# EasyEDA Pro project ProProject_阵列式磁场检测仪_2024-06-02.epro, schematic Schematic1
Create Date: 2024-04-22; Page Name: P1; Project Name: 阵列式磁场检测仪; Schematic Name: Schematic1; Update Date: 2024-05-02; Company: 嘉立创EDA; Page Size: A4; Version: V1.0
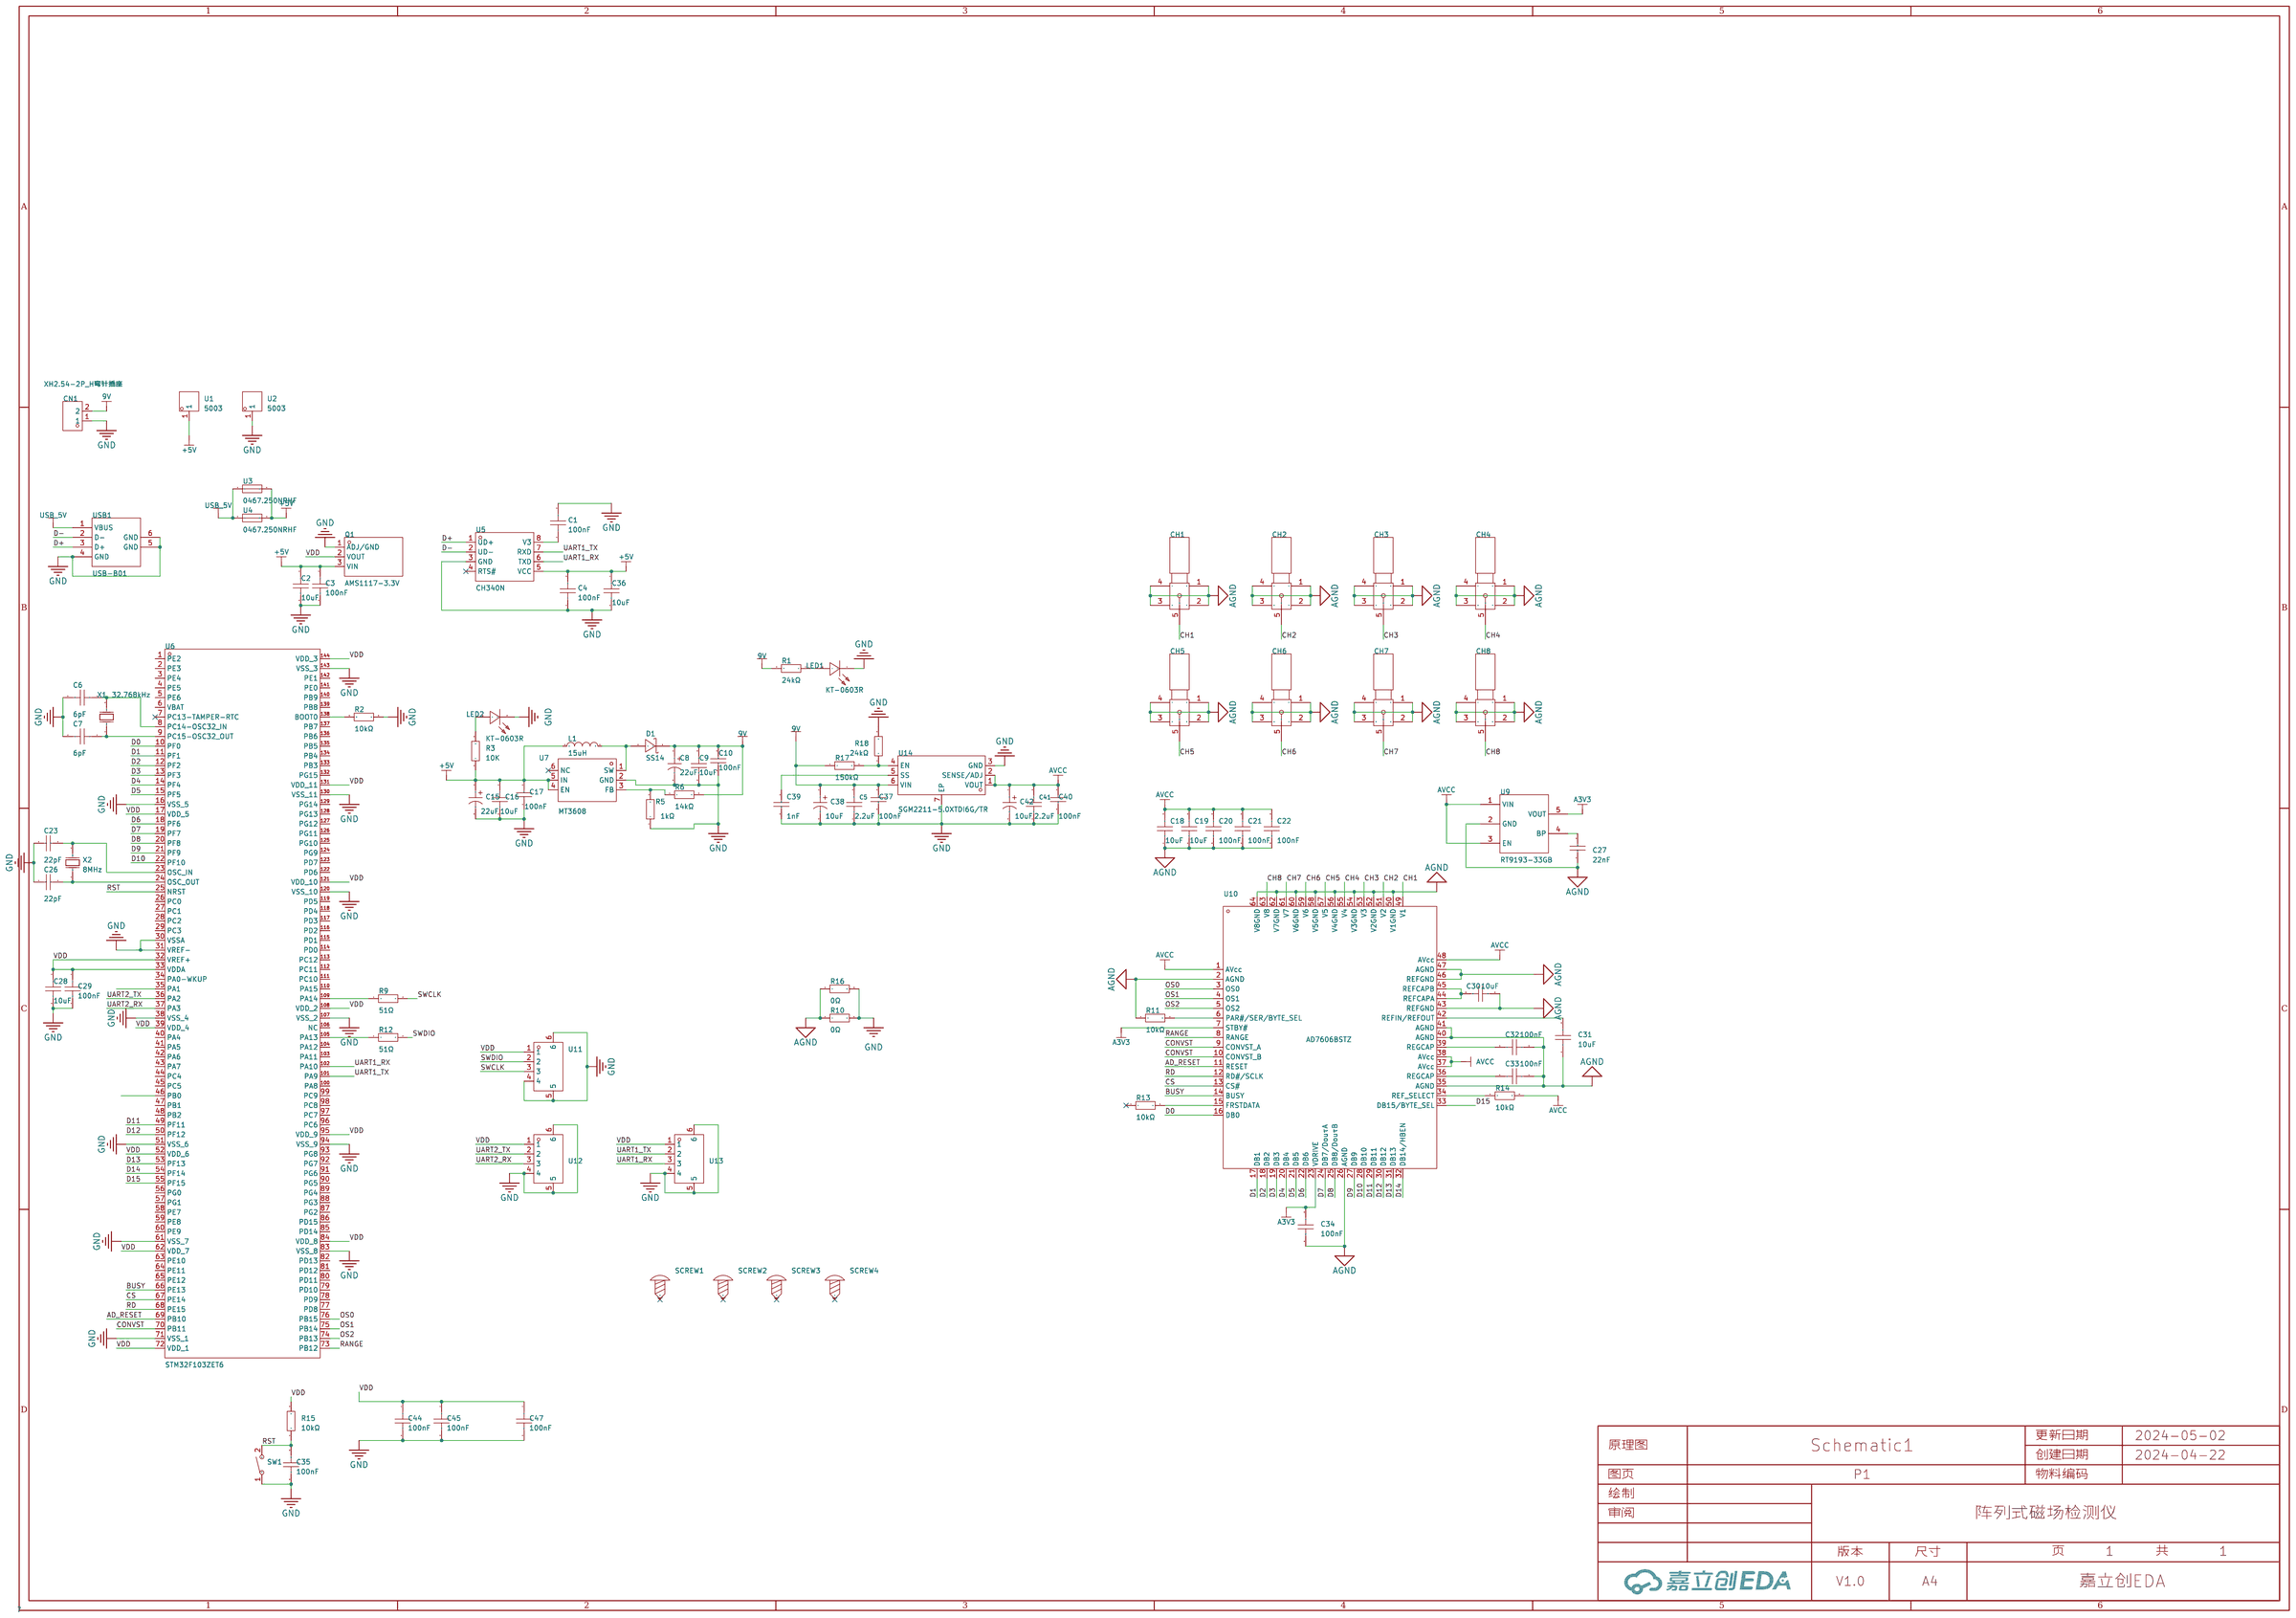
[diagram p0: schematic sheet]

## Parts
C1  100nF  [C0603]
C2  10uF  [C0805]
C3  100nF  [C0603]
C4  100nF  [C0603]
C5  2.2uF  [C0603]
C6  6pF  [C0603]
C7  6pF  [C0603]
C8  22uF  [CAP-SMD_BD5.0-L5.3-W5.3-LS6.0-FD]
C9  10uF  [C0805]
C10  100nF  [C0603]
C15  22uF  [CAP-SMD_BD5.0-L5.3-W5.3-LS6.0-FD]
C16  10uF  [C0805]
C17  100nF  [C0603]
C18  10uF  [C0805]
C19  10uF  [C0805]
C20  100nF  [C0603]
C21  100nF  [C0603]
C22  100nF  [C0603]
C23  22pF  [C0603]
C26  22pF  [C0603]
C27  22nF  [C0603]
C28  10uF  [C0805]
C29  100nF  [C0603]
C30  10uF  [C0805]
C31  10uF  [C0805]
C32  100nF  [C0603]
C33  100nF  [C0603]
C34  100nF  [C0603]
C35  100nF  [C0603]
C36  10uF  [C0805]
C37  100nF  [C0603]
C38  10uF  [CAP-SMD_BD5.0-L5.3-W5.3-FD]
C39  1nF  [C0603]
C40  100nF  [C0603]
C41  2.2uF  [C0603]
C42  10uF  [CAP-SMD_BD5.0-L5.3-W5.3-FD]
C44  100nF  [C0603]
C45  100nF  [C0603]
C47  100nF  [C0603]
CH1  BWSMA-KWE-Z001  [SMA-TH_BWSMA-KWE-Z001]
CH2  BWSMA-KWE-Z001  [SMA-TH_BWSMA-KWE-Z001]
CH3  BWSMA-KWE-Z001  [SMA-TH_BWSMA-KWE-Z001]
CH4  BWSMA-KWE-Z001  [SMA-TH_BWSMA-KWE-Z001]
CH5  BWSMA-KWE-Z001  [SMA-TH_BWSMA-KWE-Z001]
CH6  BWSMA-KWE-Z001  [SMA-TH_BWSMA-KWE-Z001]
CH7  BWSMA-KWE-Z001  [SMA-TH_BWSMA-KWE-Z001]
CH8  BWSMA-KWE-Z001  [SMA-TH_BWSMA-KWE-Z001]
CN1  XH2.54-2P_H弯针插座  [CONN-TH_2P-P2.5_XH2.54-2P_H]
D1  SS14  [SMA_L4.2-W2.6-LS5.3-RD]
L1  15uH  [IND-SMD_L5.2-W5.2_YSPI0530]
LED1  KT-0603R  [LED0603-RD]
LED2  KT-0603R  [LED0603-RD]
Q1  AMS1117-3.3V  [SOT-89-3_L4.5-W2.5-P1.50-LS4.2-BR]
R1  24kΩ  [R0603]
R2  10kΩ  [R0603]
R3  10K  [R0603]
R5  1kΩ  [R0603]
R6  14kΩ  [R0603]
R9  51Ω  [R0603]
R10  0Ω  [R1206]
R11  10kΩ  [R0603]
R12  51Ω  [R0603]
R13  10kΩ  [R0603]
R14  10kΩ  [R0603]
R15  10kΩ  [R0603]
R16  0Ω  [R1206]
R17  150kΩ  [R0603]
R18  24kΩ  [R0603]
SCREW1  -  [M3螺丝]
SCREW2  -  [M3螺丝]
SCREW3  -  [M3螺丝]
SCREW4  -  [M3螺丝]
SW1  TS-1092S-B3D2-G  [SW-SMD_L6.1-W3.6-LS7.9]
U1  5003  [TEST-TH_BD2.54-P1.39]
U2  5003  [TEST-TH_BD2.54-P1.39]
U3  0467.250NRHF  [F0603]
U4  0467.250NRHF  [F0603]
U5  CH340N  [SOP-8_L4.9-W3.9-P1.27-LS6.0-BL]
U6  STM32F103ZET6  [LQFP-144_L20.0-W20.0-P0.50-LS22.0-BL]
U7  MT3608  [SOT-23-6_L2.9-W1.6-P0.95-LS2.8-BL]
U9  RT9193-33GB  [SOT-23-5_L3.0-W1.7-P0.95-LS2.8-BL]
U10  AD7606BSTZ  [LQFP-64_L10.0-W10.0-P0.50-LS12.0-BL]
U11  WAFER-GH1.25-4PWB  [CONN-SMD_4P-P1.25_XUNPU_WAFER-GH1.25-4PWB]
U12  WAFER-GH1.25-4PWB  [CONN-SMD_4P-P1.25_XUNPU_WAFER-GH1.25-4PWB]
U13  WAFER-GH1.25-4PWB  [CONN-SMD_4P-P1.25_XUNPU_WAFER-GH1.25-4PWB]
U14  SGM2211-5.0XTDI6G/TR  [TDFN-6_L2.0-W2.0-P0.65-BL-EP]
USB1  USB-B01  [USB-B-TH_USB-B01]
X1  32.768kHz  [CRYSTAL-SMD_L3.2-W1.5-1]
X2  8MHz  [CRYSTAL-SMD_L5.0-W3.2]

## Library data of the parts
C1 C4 = CC0603KRX7R9BB104: 温度系数:X7R;容值:100nF;电容体长:-;精度:±10%;电容体宽:-;电容体厚度:-;额定电压:50V;; LCSC Part Name: 100nF ±10% 50V; Supplier Part: C14663; Manufacturer: YAGEO(国巨); Supplier Footprint: 0603; JLCPCB Part Class: Basic Part; Datasheet: https://atta.szlcsc.com/upload/public/pdf/source/20170116/1484561234239.pdf; Supplier: LCSC; Tolerance: ±10%; Voltage Rated: 50V; Temperature Coefficient: X7R
C2 C9 C16 C18 C19 C28 C30 C31 C36 = CL21A106KAYNNNE_C15850: 容值:10uF;精度:±10%;额定电压:25V;材质(温度系数):X5R;; LCSC Part Name: 10uF ±10% 25V; Supplier Part: C15850; Manufacturer: SAMSUNG(三星); Manufacturer Part: CL21A106KAYNNNE; Supplier Footprint: 0805; Datasheet: https://atta.szlcsc.com/upload/public/pdf/source/20160218/1457707763339.pdf; Supplier: LCSC; Tolerance: ±10%; Voltage Rated: 25V; Temperature Coefficient: X5R
C3 C20-C22 C29 C32-C35 C44 C45 C47 = CC0603KRX7R9BB104: 容值:100nF;精度:±10%;额定电压:50V;材质(温度系数):X7R;; LCSC Part Name: 100nF ±10% 50V; Supplier Part: C14663; Manufacturer: YAGEO(国巨); Supplier Footprint: 0603; Datasheet: https://atta.szlcsc.com/upload/public/pdf/source/20180910/C282072_33301C7F631E79921B82A8DAC6BCC5B3.pdf; Supplier: LCSC; Tolerance: ±10%; Voltage Rated: 50V; Temperature Coefficient: X7R
C5 C41 = CL10A225KB8NNNC: 容值:2.2uF;精度:±10%;额定电压:50V;材质(温度系数):X5R;; LCSC Part Name: 2.2uF ±10% 50V; Supplier Part: C913904; Manufacturer: SAMSUNG(三星); Supplier Footprint: 0603; Datasheet: https://atta.szlcsc.com/upload/public/pdf/source/20160218/1457707763339.pdf; Supplier: LCSC; Tolerance: ±10%; Voltage Rated: 50V; Temperature Coefficient: X5R
C6 C7 = CGA3E2C0G1H060D080AD: 容值:6pF;额定电压:50V;材质(温度系数):C0G;; LCSC Part Name: 6pF 50V; Supplier Part: C2182750; Manufacturer: TDK; Supplier Footprint: 0603; JLCPCB Part Class: 扩展库; Datasheet: https://atta.szlcsc.com/upload/public/pdf/source/20210427/4892FA4C59E7E6B03D1B6D7A54E21E17.pdf; Supplier: LCSC; Voltage Rated: 50V; Temperature Coefficient: C0G
C8 C15 = RVT22UF25V67RV0047: 容值:22uF;精度:±20%;额定电压:25V;纹波电流:26mA@120Hz;等效串联电阻:-;; LCSC Part Name: 22uF ±20% 25V; Supplier Part: C2895283; Manufacturer: KNSCHA(科尼盛); Supplier Footprint: SMD,D5xL5.4mm; Datasheet: https://atta.szlcsc.com/upload/public/pdf/source/20210913/932E3E330BEA7074461466B23B823DC6.pdf; Supplier: LCSC; Tolerance: ±20%; Rated Voltage: 25V; Ripple Current: 26mA@120Hz; φD: 5mm; L: 5.4mm; Lifetime @ Temp: 2000hrs@105℃; Operating Temperature: -55℃~+105℃
C10 C17 C37 C40 = 0603B104K500NT: 容值:100nF;精度:±10%;额定电压:50V;材质(温度系数):X7R;; LCSC Part Name: 100nF ±10% 50V; Supplier Part: C30926; Manufacturer: FH(风华); Supplier Footprint: 0603; Datasheet: https://atta.szlcsc.com/upload/public/pdf/source/20200305/C486355_26A10D38EF8C2A5C37091D0039909270.pdf; Supplier: LCSC; Tolerance: ±10%; Voltage Rated: 50V; Temperature Coefficient: X7R
C23 C26 = CL10C220JB8NNNC: 容值:22pF;精度:±5%;额定电压:50V;材质(温度系数):C0G;; LCSC Part Name: 22pF ±5% 50V; Supplier Part: C1653; Manufacturer: SAMSUNG(三星); Supplier Footprint: 0603; Datasheet: https://atta.szlcsc.com/upload/public/pdf/source/20160218/1457707763339.pdf; Supplier: LCSC; Tolerance: ±5%; Voltage Rated: 50V; Temperature Coefficient: C0G
C27 = CL10B223KB8NNNC: 容值:22nF;精度:±10%;额定电压:50V;材质(温度系数):X7R;; LCSC Part Name: 22nF ±10% 50V; Supplier Part: C21122; Manufacturer: SAMSUNG(三星); Supplier Footprint: 0603; Datasheet: https://atta.szlcsc.com/upload/public/pdf/source/20160218/1457707763339.pdf; Supplier: LCSC; Tolerance: ±10%; Voltage Rated: 50V; Temperature Coefficient: X7R
C38 C42 = RST10UF50V016: 容值:10uF;精度:±20%;额定电压:50V;纹波电流:24mA@120Hz;等效串联电阻:-;; LCSC Part Name: 10uF ±20% 50V; Supplier Part: C4747971; Manufacturer: KNSCHA(科尼盛); Supplier Footprint: SMD,D5xL5.4mm; Datasheet: https://atta.szlcsc.com/upload/public/pdf/source/20220722/47144637C831FC4476CE4962252D8002.pdf; Supplier: LCSC; Tolerance: ±20%; Rated Voltage: 50V; Ripple Current: 24mA@120Hz; φD: 5mm; L: 5.4mm; Lifetime @ Temp: 2000hrs@105℃; Operating Temperature: -40℃~+105℃
C39 = CC0603KRX7R9BB102: 容值:1nF;精度:±10%;额定电压:50V;材质(温度系数):X7R;; LCSC Part Name: 1nF ±10% 50V; Supplier Part: C100040; Manufacturer: YAGEO(国巨); Supplier Footprint: 0603; Datasheet: https://atta.szlcsc.com/upload/public/pdf/source/20180910/C282072_33301C7F631E79921B82A8DAC6BCC5B3.pdf; Supplier: LCSC; Tolerance: ±10%; Voltage Rated: 50V; Temperature Coefficient: X7R
CH1-CH8 = BWSMA-KWE-Z001: 连接器类型:板端;接口类型:内孔;端口数量:1;接口直径:5.3mm;接口长度/高度:-;频率-最大值:-;射频系列:SMA;阻抗:50Ω;样式:弯头;触头材质:-;触头镀层:-;工作温度范围:-;焊接温度(最大值):-;; LCSC Part Name: 内孔 SMA 弯头; Supplier Part: C496551; Manufacturer: BAT WIRELESS(蝙蝠无线); Supplier Footprint: 插件; Datasheet: https://atta.szlcsc.com/upload/public/pdf/source/20231017/997A8C2ADA7F8034A89BE1264F38CE52.pdf; Supplier: LCSC; Connector Type: 板端; Interface Type: 内孔; Number of Ports: 1; Interface Diameter: 5.3mm; RF Series: SMA; Impedance: 50Ω; Style: 弯头
CN1 = XH2.54-2P_H弯针插座: Supplier Part: C2915111; Supplier Footprint: TH-2P; JLCPCB Part Class: 扩展库; Supplier: LCSC
D1 = SS14_C2480: 二极管配置:独立式;正向压降(Vf):550mV@1A;直流反向耐压(Vr):40V;平均整流电流(Io):1A;; LCSC Part Name: 电压:40V 电流:1A; Supplier Part: C2480; Manufacturer: MDD; Supplier Footprint: SMA(DO-214AC); Datasheet: https://atta.szlcsc.com/upload/public/pdf/source/20230712/2DB6064CFBB99DE6DB116BEE8208BE66.pdf; Supplier: LCSC; Diode Configuration: 独立式; Forward Voltage (Vf@If): 550mV@1A; Reverse Voltage (Vr): 40V; Average Rectified Current (Io): 1A; Reverse Leakage Current (Ir): 500uA@40V
L1 = YSPI0530-150M: 电感值:15uH;精度:±20%;额定电流:2.1A;; LCSC Part Name: 15uH ±20%; Supplier Part: C497861; Manufacturer: YJYCOIN(益嘉源); Supplier Footprint: SMD,5.4x5.2x3mm; Datasheet: https://atta.szlcsc.com/upload/public/pdf/source/20200317/C497860_F2BFA4F4324DE880FC2D7AD862E4A32B.pdf; Supplier: LCSC; Tolerance: ±20%; Rated Current: 2.1A; DC Resistance (DCR): 190mΩ
LED1 LED2 = KT-0603R: 发光颜色:红色;功率:-;正向电流:-;主波长:-;二极管配置:-;透镜颜色:-;色温:-;发光角度:-;载带方式:-;工作温度:-40℃~+85℃;; LCSC Part Name: 0603 红灯 高亮; Supplier Part: C2286; Manufacturer: KENTO; Supplier Footprint: 0603; JLCPCB Part Class: 基础库; Datasheet: https://atta.szlcsc.com/upload/public/pdf/source/20160616/1466072038404.pdf; Supplier: LCSC; Emitted Color: 红色; Operating Temperature: -40℃~+85℃
Q1 = AMS1117-3.3V_C5120796: 输出类型:固定;最大输入电压:18V;输出电压:3.3V;最大输出电流:1A;输出极性:正极;; LCSC Part Name: 输入18V 输出3.3V 1A; Supplier Part: C5120796; Manufacturer: MSKSEMI(美森科); Supplier Footprint: SOT-89; Datasheet: https://atta.szlcsc.com/upload/public/pdf/source/20231123/6117526697EB8BF6175FDEEBA0877266.pdf; Supplier: LCSC; Output Type: 固定; Maximum Input Voltage: 18V; Output Voltage: 3.3V; MAX Output Current: 1A; Dropout Voltage: 1.4V@(1A); standby current: 12mA; Operating Temperature: 0℃~+125℃; Output Polarity: 正极; Number of Outputs: 1
R1 R18 = 0603WAF2402T5E: 电阻类型:厚膜电阻;阻值:24kΩ;精度:±1%;功率:100mW;最大工作电压:75V;温度系数:±100ppm/℃;; LCSC Part Name: 24kΩ ±1% 100mW 厚膜电阻; Supplier Part: C23352; Manufacturer: UNI-ROYAL(厚声); Supplier Footprint: 0603; JLCPCB Part Class: 基础库; Datasheet: https://atta.szlcsc.com/upload/public/pdf/source/20200306/C422600_1E6D84923E4A46A82E41ADD87F860B5C.pdf; Supplier: LCSC; Type: 厚膜电阻; Tolerance: ±1%; Power(Watts): 100mW; Overload Voltage (Max): 75V; Temperature Coefficient: ±100ppm/℃; Operating Temperature Range: -55℃~+155℃
R2 R11 R13-R15 = 0603WAF1002T5E: 电阻类型:厚膜电阻;阻值:10kΩ;精度:±1%;功率:100mW;最大工作电压:75V;温度系数:±100ppm/℃;; LCSC Part Name: 厚膜电阻 10kΩ ±1% 100mW; Supplier Part: C25804; Manufacturer: UNI-ROYAL(厚声); Supplier Footprint: 0603; Datasheet: https://atta.szlcsc.com/upload/public/pdf/source/20200306/C422600_1E6D84923E4A46A82E41ADD87F860B5C.pdf; Supplier: LCSC; Type: 厚膜电阻; Tolerance: ±1%; Power(Watts): 100mW; Overload Voltage (Max): 75V; Temperature Coefficient: ±100ppm/℃; Operating Temperature Range: -55℃~+155℃
R3 = Res_0603: Supplier Footprint: 0603
R5 = 0603WAF1001T5E: 电阻类型:厚膜电阻;阻值:1kΩ;精度:±1%;功率:100mW;最大工作电压:75V;温度系数:±100ppm/℃;; LCSC Part Name: 1kΩ ±1% 100mW 厚膜电阻; Supplier Part: C21190; Manufacturer: UNI-ROYAL(厚声); Supplier Footprint: 0603; Datasheet: https://atta.szlcsc.com/upload/public/pdf/source/20200306/C422600_1E6D84923E4A46A82E41ADD87F860B5C.pdf; Supplier: LCSC; Type: 厚膜电阻; Tolerance: ±1%; Power(Watts): 100mW; Overload Voltage (Max): 75V; Temperature Coefficient: ±100ppm/℃; Operating Temperature Range: -55℃~+155℃
R6 = 0603WAF1402T5E: 电阻类型:厚膜电阻;阻值:14kΩ;精度:±1%;功率:100mW;最大工作电压:75V;温度系数:±100ppm/℃;; LCSC Part Name: 14kΩ ±1% 100mW 厚膜电阻; Supplier Part: C22803; Manufacturer: UNI-ROYAL(厚声); Supplier Footprint: 0603; Datasheet: https://atta.szlcsc.com/upload/public/pdf/source/20200306/C422600_1E6D84923E4A46A82E41ADD87F860B5C.pdf; Supplier: LCSC; Type: 厚膜电阻; Tolerance: ±1%; Power(Watts): 100mW; Overload Voltage (Max): 75V; Temperature Coefficient: ±100ppm/℃; Operating Temperature Range: -55℃~+155℃
R9 R12 = 0603WAF510JT5E: 电阻类型:厚膜电阻;阻值:51Ω;精度:±1%;功率:100mW;最大工作电压:75V;温度系数:±100ppm/℃;; LCSC Part Name: 51Ω ±1% 100mW 厚膜电阻; Supplier Part: C23197; Manufacturer: UNI-ROYAL(厚声); Supplier Footprint: 0603; Datasheet: https://atta.szlcsc.com/upload/public/pdf/source/20200306/C422600_1E6D84923E4A46A82E41ADD87F860B5C.pdf; Supplier: LCSC; Type: 厚膜电阻; Tolerance: ±1%; Power(Watts): 100mW; Overload Voltage (Max): 75V; Temperature Coefficient: ±100ppm/℃; Operating Temperature Range: -55℃~+155℃
R10 R16 = 1206W4F0000T5E: 电阻类型:厚膜电阻;阻值:0Ω;精度:±1%;功率:250mW;最大工作电压:200V;温度系数:±800ppm/℃;; LCSC Part Name: 0Ω ±1% 250mW 厚膜电阻; Supplier Part: C17888; Manufacturer: UNI-ROYAL(厚声); Supplier Footprint: 1206; JLCPCB Part Class: 基础库; Datasheet: https://atta.szlcsc.com/upload/public/pdf/source/20200306/C422600_1E6D84923E4A46A82E41ADD87F860B5C.pdf; Supplier: LCSC; Type: 厚膜电阻; Tolerance: ±1%; Power(Watts): 250mW; Overload Voltage (Max): 200V; Temperature Coefficient: ±800ppm/℃; Operating Temperature Range: -55℃~+155℃
R17 = 0603WAF1503T5E: 电阻类型:厚膜电阻;阻值:150kΩ;精度:±1%;功率:100mW;最大工作电压:75V;温度系数:±100ppm/℃;; LCSC Part Name: 150kΩ ±1% 100mW 厚膜电阻; Supplier Part: C22807; Manufacturer: UNI-ROYAL(厚声); Supplier Footprint: 0603; JLCPCB Part Class: 基础库; Datasheet: https://atta.szlcsc.com/upload/public/pdf/source/20200306/C422600_1E6D84923E4A46A82E41ADD87F860B5C.pdf; Supplier: LCSC; Type: 厚膜电阻; Tolerance: ±1%; Power(Watts): 100mW; Overload Voltage (Max): 75V; Temperature Coefficient: ±100ppm/℃; Operating Temperature Range: -55℃~+155℃
SCREW1-SCREW4 = M3螺丝: Supplier Footprint: 插件
SW1 = TS-1092S-B3D2-G: 电路结构:单刀单掷;按钮形状:矩形按钮;作用力:250gf;安装方式:立贴;开关长度:6.1mm;开关宽度:3.6mm;开关高度:2.5mm;带支架:不带;机械寿命:-;; LCSC Part Name: 6.1*3.6*2.5mm 立贴 轻触开关; Supplier Part: C520860; Manufacturer: Yuandi(元迪); Supplier Footprint: SMD; Datasheet: https://atta.szlcsc.com/upload/public/pdf/source/20200424/C520860_DA5AE47D9A9DC527FC720B5FF0895739.pdf; Supplier: LCSC; Circuit: 单刀单掷; Actuator Style: 矩形按钮; Operating Force: 250gf; Mounting Style: 立贴; Switch Length: 6.1mm; Switch Width: 3.6mm; Switch Height: 2.5mm; Strike Gundam: 不带; Actuator/Cap Color: 灰色; Pin Style: 鸥翼型
U1 U2 = 5003: 类型:测试环;全长/全高:7.62mm;工作高度:-;接触电阻:-;弹性寿命:-;额定电流:-;额定电压:-;触头材质:磷青铜;触头镀层:-;工作温度范围:-;; Supplier Part: C238124; Manufacturer: Keystone; Datasheet: https://atta.szlcsc.com/upload/public/pdf/source/20211115/64B944F8418AA2CF0680BB1B201435FB.pdf; Supplier: LCSC; Type: 测试环; Overall Length/Height: 7.62mm; Contact Material: 磷青铜
U3 U4 = 0467.250NRHF: 类型:贴片式保险丝;额定电流:250mA;额定电压 (AC):32V;额定电压 (DC):32V;分断能力:50A;; LCSC Part Name: 32V贴片式保险丝; Supplier Part: C151137; Manufacturer: Littelfuse(美国力特); Supplier Footprint: 0603; Datasheet: https://atta.szlcsc.com/upload/public/pdf/source/20171201/C151140_15121178500441156397.pdf; Supplier: LCSC; Type: 贴片式保险丝; Current Rating: 250mA; Voltage Rating  (AC): 32V; Voltage Rating (DC): 32V; Operating Temperature: -55℃~+90℃; Breaking Capacity: 50A
U5 = CH340N: Supplier Part: C2977777; Manufacturer: WCH(南京沁恒); Supplier Footprint: SOP-8; JLCPCB Part Class: Extended Part; Datasheet: https://atta.szlcsc.com/upload/public/pdf/source/20220223/82A45E4FF89B3EDCAD50B354450A7EF4.pdf; Supplier: LCSC
U6 = STM32F103ZET6: CPU内核:CM3;程序存储容量:512KB;RAM总容量:64KB;GPIO端口数量:112;工作电压范围:2V~3.6V;CPU最大主频:72MHz;程序存储器类型:FLASH;; Supplier Part: C8287; Manufacturer: ST(意法半导体); Supplier Footprint: LQFP-144(20x20); Datasheet: https://atta.szlcsc.com/upload/public/pdf/source/20180327/C88435_0E51D69B5FFD7B1A3F36EB9FC047A4C2.pdf; Supplier: LCSC; CPU Core: CM3; Program Storage Size: 512KB; RAM Size: 64KB; GPIO Ports Number: 112; Operating Voltage Range: 2V~3.6V; CPU Maximum Speed: 72MHz; Program Memory Type: FLASH; Operating Temperature Range: -40℃~+85℃; ADC (Bit): 12bit; DAC (Bit): 12bit; Universal Serial Bus: 有; Peripheral/Function: DMA；片载温度传感器；PWM; Watchdog: 有; Infrared Data Association: 有; Low-Voltage Detect: 有; Direct Memory Access: 有; Internal Oscillator: 有
U7 = MT3608: 功能类型:升压型;输入电压:2V~24V;输出电压:28V;输出电流(最大值):-;; Supplier Part: C84817; Manufacturer: 西安航天民芯; Supplier Footprint: SOT-23-6; JLCPCB Part Class: 扩展库; Datasheet: https://atta.szlcsc.com/upload/public/pdf/source/20161110/1478743351706.pdf; Supplier: LCSC; Function: 升压型; Input Voltage: 2V~24V; Output Voltage: 28V; Switching Frequency: 1.2MHz; Number of Outputs: 1; Topology: 升压式; Switch tube (built-in/external): 内置
U9 = RT9193-33GB: 输出类型:固定;最大输入电压:5.5V;输出电压:3.3V;最大输出电流:300mA;电源纹波抑制比(PSRR):70dB;输出极性:正极;; LCSC Part Name: 输入5.5V 输出3.3V 300mA; Supplier Part: C15651; Manufacturer: RICHTEK(立锜); Supplier Footprint: SOT-23-5; Datasheet: https://atta.szlcsc.com/upload/public/pdf/source/20130730/1457706628575.pdf; Supplier: LCSC; Output Type: 固定; Maximum Input Voltage: 5.5V; Output Voltage: 3.3V; MAX Output Current: 300mA; Power Supply Rejection Ratio (PSRR): 70dB; Dropout Voltage: 300mV@(300mA); standby current: 130uA; Operating Temperature: -40℃~+125℃; Output Polarity: 正极; Number of Outputs: 1
U10 = AD7606BSTZ: 供电电压:2.3V~5.25V；4.75V~5.25V;分辨率(位):16;; LCSC Part Name: 8通道 200kHz 16位ADC DSP接口; Supplier Part: C398827; Manufacturer: ADI(亚德诺); Supplier Footprint: LQFP-64(10x10); Datasheet: https://atta.szlcsc.com/upload/public/pdf/source/20200312/C495029_477E5B714CC8ADA3D7A4ECEA0C949302.pdf; Supplier: LCSC; Supply Voltage: 2.3V~5.25V；4.75V~5.25V; Number of Channels: 8; Resolution: 16; Operating Temperature: -40℃~+85℃
U11-U13 = WAFER-GH1.25-4PWB: 插针结构:1x4P;间距:1.25mm;安装方式:卧贴;参考系列:GH;总PIN数:4P;排数:1;每排PIN数:4;额定电流:1A;工作温度范围:-25℃~+85℃;; LCSC Part Name: 1x4P 间距:1.25mm 卧贴 系列:GH; Supplier Part: C3029379; Manufacturer: XUNPU(讯普); Supplier Footprint: SMD,P=1.25mm,卧贴; Datasheet: https://atta.szlcsc.com/upload/public/pdf/source/20220527/CB8773BFB0913C3B8ABD62CB38BA101A.pdf; Supplier: LCSC; Pins Structure: 1x4P; Pitch: 1.25mm; Mounting Style: 卧贴; Reference Series: GH; Number of Pins: 4P; Number of Rows: 1; Number of PINs Per Row: 4; Current Rating (Max): 1A; Operating Temperature Range: -25℃~+85℃
U14 = SGM2211-1.8XTDI6G/TR: Supplier Part: C5152834; Manufacturer: SGMICRO(圣邦微); Supplier Footprint: TDFN-6AL(2x2); JLCPCB Part Class: 扩展库; Datasheet: https://atta.szlcsc.com/upload/public/pdf/source/20220928/26A0674FCF0885761ED3B533E1830369.pdf; Supplier: LCSC
USB1 = USB-B01: 连接器类型:Type-B;标准:USB 2.0;公母:母;端口数量:1;触点数量:4P;安装方式:弯插;额定电流 - 电源:-;工作温度范围:-;; LCSC Part Name: Type-B 母 弯插; Supplier Part: C498173; Manufacturer: SOFNG(硕方); Supplier Footprint: 插件; Datasheet: https://atta.szlcsc.com/upload/public/pdf/source/20200812/C498173_CFDA774068C8841191F9DEBD85971FB5.pdf; Supplier: LCSC; Connector Type: Type-B; Standard: USB 2.0; Gender: 母; Number of Ports: 1; Number of Contacts: 4P; Mounting Style: 弯插
X1 = XKXGI-SUA-32.768K: 晶振类型:贴片晶振;频率:32.768kHz;常温频差:±20ppm;外接负载电容:12.5pF;频率稳定度(全温):±30ppm;; LCSC Part Name: 32.768kHz ±20ppm 12.5pF YST310S; Supplier Part: C5213671; Manufacturer: YXC(扬兴晶振); Supplier Footprint: SMD3215-2P; JLCPCB Part Class: 扩展库; Datasheet: https://atta.szlcsc.com/upload/public/pdf/source/20240329/3A7650FD985DD0DE85694D3785AB4916.pdf; Supplier: LCSC; Crystal Type: 贴片晶振; Normal temperature Frequency Tolerance: ±20ppm; External load capacitor: 12.5pF; Frequency Stability(Full temperature range): ±30ppm; Operating Temperature: -40℃~+85℃
X2 = X50328MSB2GI: 晶振类型:贴片晶振;频率:8MHz;常温频差:±10ppm;外接负载电容:20pF;频率稳定度(全温):±20ppm;; LCSC Part Name: 8MHz ±10ppm 20pF YSX530GA; Supplier Part: C115962; Manufacturer: YXC(扬兴晶振); Supplier Footprint: SMD5032; Datasheet: https://atta.szlcsc.com/upload/public/pdf/source/20240329/44922B0AF7B60E58E9B66993B6077277.pdf; Supplier: LCSC; Crystal Type: 贴片晶振; Normal temperature Frequency Tolerance: ±10ppm; External load capacitor: 20pF; Frequency Stability(Full temperature range): ±20ppm; Operating Temperature: -40℃~+85℃

## Nets
9V: C5.2 C8.1 C9.2 C10.2 C37.2 C38.1 CN1.2 D1.1(K) R1.2 R6.2 R17.1 U14.6(VIN)
+5V: C2.1 C3.1 C4.2 C15.1 C16.1 C17.2 C36.1 L1.1 Q1.3(VIN) R3.1 U1.1 U3.2 U4.2 U5.5(VCC) U7.4(EN) U7.5(IN)
A3V3: C34.2 U9.5(VOUT) U10.7(STBY#) U10.23(VDRIVE)
AGND: C18.1 C19.1 C20.2 C21.2 C22.2 C27.1 C30.1 C31.1 C32.1 C33.1 C34.1 CH1.1 CH1.2 CH1.3 CH1.4 CH2.1 CH2.2 CH2.3 CH2.4 CH3.1 CH3.2 CH3.3 CH3.4 CH4.1 CH4.2 CH4.3 CH4.4 CH5.1 CH5.2 CH5.3 CH5.4 CH6.1 CH6.2 CH6.3 CH6.4 CH7.1 CH7.2 CH7.3 CH7.4 CH8.1 CH8.2 CH8.3 CH8.4 R10.1 R11.1 R16.1 U9.2(GND) U10.2(AGND) U10.26(AGND) U10.35(AGND) U10.40(AGND) U10.41(AGND) U10.43(REFGND) U10.46(REFGND) U10.47(AGND) U10.50(V1GND) U10.52(V2GND) U10.54(V3GND) U10.56(V4GND) U10.58(V5GND) U10.60(V6GND) U10.62(V7GND) U10.64(V8GND)
AVCC: C18.2 C19.2 C20.1 C21.1 C22.1 C40.2 C41.2 C42.1 R14.2 U9.1(VIN) U9.3(EN) U10.1(AVcc) U10.37(AVcc) U10.38(AVcc) U10.48(AVcc) U14.1(VOUT) U14.2(SENSE/ADJ)
GND: C1.2 C2.2 C3.2 C4.1 C5.1 C6.2 C7.2 C8.2 C9.1 C10.1 C15.2 C16.2 C17.1 C23.1 C26.1 C28.2 C29.2 C35.2 C36.2 C37.1 C38.2 C39.2 C40.1 C41.1 C42.2 C44.2 C45.2 C47.2 CN1.1 LED1.1(K) LED2.1(K) Q1.1(ADJ/GND) R2.2 R5.1 R10.2 R16.2 R18.2 SW1.1 U2.1 U5.3(GND) U6.16(VSS_5) U6.30(VSSA) U6.31(VREF-) U6.38(VSS_4) U6.51(VSS_6) U6.61(VSS_7) U6.71(VSS_1) U6.83(VSS_8) U6.94(VSS_9) U6.107(VSS_2) U6.120(VSS_10) U6.130(VSS_11) U6.143(VSS_3) U7.2(GND) U11.4 U11.5 U11.6 U12.4 U12.5 U12.6 U13.4 U13.5 U13.6 U14.3(GND) U14.7(EP) USB1.4(GND) USB1.5(GND) USB1.6(GND)
VDD: C28.1 C29.1 C44.1 C45.1 C47.1 Q1.2(VOUT) R15.2 U6.17(VDD_5) U6.32(VREF+) U6.33(VDDA) U6.39(VDD_4) U6.52(VDD_6) U6.62(VDD_7) U6.72(VDD_1) U6.84(VDD_8) U6.95(VDD_9) U6.108(VDD_2) U6.121(VDD_10) U6.131(VDD_11) U6.144(VDD_3) U11.1 U12.1 U13.1
AD_RESET: U6.69(PB10) U10.11(RESET)
BUSY: U6.66(PE13) U10.14(BUSY)
CH1: CH1.5 U10.49(V1)
CH2: CH2.5 U10.51(V2)
CH3: CH3.5 U10.53(V3)
CH4: CH4.5 U10.55(V4)
CH5: CH5.5 U10.57(V5)
CH6: CH6.5 U10.59(V6)
CH7: CH7.5 U10.61(V7)
CH8: CH8.5 U10.63(V8)
CONVST: U6.70(PB11) U10.9(CONVST_A) U10.10(CONVST_B)
CS: U6.67(PE14) U10.13(CS#)
D0: U6.10(PF0) U10.16(DB0)
D1: U6.11(PF1) U10.17(DB1)
D2: U6.12(PF2) U10.18(DB2)
D3: U6.13(PF3) U10.19(DB3)
D4: U6.14(PF4) U10.20(DB4)
D5: U6.15(PF5) U10.21(DB5)
D6: U6.18(PF6) U10.22(DB6)
D7: U6.19(PF7) U10.24(DB7/DouτA)
D8: U6.20(PF8) U10.25(DB8/DouτB)
D9: U6.21(PF9) U10.27(DB9)
D10: U6.22(PF10) U10.28(DB10)
D11: U6.49(PF11) U10.29(DB11)
D12: U6.50(PF12) U10.30(DB12)
D13: U6.53(PF13) U10.31(DB13)
D14: U6.54(PF14) U10.32(DB14/HBEN)
D15: U6.55(PF15) U10.33(DB15/BYTE_SEL)
D+: U5.1(UD+) USB1.3(D+)
D-: U5.2(UD-) USB1.2(D-)
OS0: U6.76(PB15) U10.3(OS0)
OS1: U6.75(PB14) U10.4(OS1)
OS2: U6.74(PB13) U10.5(OS2)
RANGE: U6.73(PB12) U10.8(RANGE)
RD: U6.68(PE15) U10.12(RD#/SCLK)
RST: C35.1 R15.1 SW1.2 U6.25(NRST)
SWCLK: R9.2 U11.3
SWDIO: R12.2 U11.2
UART1_RX: U5.6(TXD) U6.102(PA10) U13.3
UART1_TX: U5.7(RXD) U6.101(PA9) U13.2
UART2_RX: U6.37(PA3) U12.3
UART2_TX: U6.36(PA2) U12.2
USB_5V: U3.1 U4.1 USB1.1(VBUS)
$1N3529: R11.2 U10.6(PAR#/SER/BYTE_SEL)
$1N3639: R13.2 U10.15(FRSTDATA)
$1N3819: R14.1 U10.34(REF_SELECT)
$1N4046: C32.2 U10.39(REGCAP)
$1N4049: C33.2 U10.36(REGCAP)
$1N4205: C31.2 U10.42(REFIN/REFOUT)
$1N4225: C30.2 U10.44(REFCAPA) U10.45(REFCAPB)
$1N5513: C6.1 U6.8(PC14-OSC32_IN) X1.2(OSC2)
$1N5519: C7.1 U6.9(PC15-OSC32_OUT) X1.1(OSC1)
$1N5854: C23.2 U6.23(OSC_IN) X2.2(OSC2)
$1N5860: C26.2 U6.24(OSC_OUT) X2.1(OSC1)
$1N6160: R2.1 U6.138(BOOT0)
$1N8425: R9.1 U6.109(PA14)
$1N8434: R12.1 U6.105(PA13)
$1N8625: C1.1 U5.8(V3)
$1N9988: D1.2(A) L1.2 U7.1(SW)
$1N9991: R5.2 R6.1 U7.3(FB)
$1N10007: LED2.2(A) R3.2
$1N10732: LED1.2(A) R1.1
$1N10962: C27.2 U9.4(BP)
$1N11961: C39.1 U14.5(SS)
$1N11962: R17.2 R18.1 U14.4(EN)

Not connected (* = marked no-connect by the designer): R13 1*; SCREW1 1*; SCREW2 1*; SCREW3 1*; SCREW4 1*; U5 4(RTS#)*; U6 1(PE2) 2(PE3) 3(PE4) 4(PE5) 5(PE6) 6(VBAT) 7(PC13-TAMPER-RTC)* 26(PC0) 27(PC1) 28(PC2) 29(PC3) 34(PA0-WKUP) 35(PA1) 40(PA4) 41(PA5) 42(PA6) 43(PA7) 44(PC4) 45(PC5) 46(PB0) 47(PB1) 48(PB2) 56(PG0) 57(PG1) 58(PE7) 59(PE8) 60(PE9) 63(PE10) 64(PE11) 65(PE12) 77(PD8) 78(PD9) 79(PD10) 80(PD11) 81(PD12) 82(PD13) 85(PD14) 86(PD15) 87(PG2) 88(PG3) 89(PG4) 90(PG5) 91(PG6) 92(PG7) 93(PG8) 96(PC6) 97(PC7) 98(PC8) 99(PC9) 100(PA8) 103(PA11) 104(PA12) 106(NC) 110(PA15) 111(PC10) 112(PC11) 113(PC12) 114(PD0) 115(PD1) 116(PD2) 117(PD3) 118(PD4) 119(PD5) 122(PD6) 123(PD7) 124(PG9) 125(PG10) 126(PG11) 127(PG12) 128(PG13) 129(PG14) 132(PG15) 133(PB3) 134(PB4) 135(PB5) 136(PB6) 137(PB7) 139(PB8) 140(PB9) 141(PE0) 142(PE1); U7 6(NC)*
